# Altium schematic sheet 涂鸦幻彩灯带.SchDoc
size A4
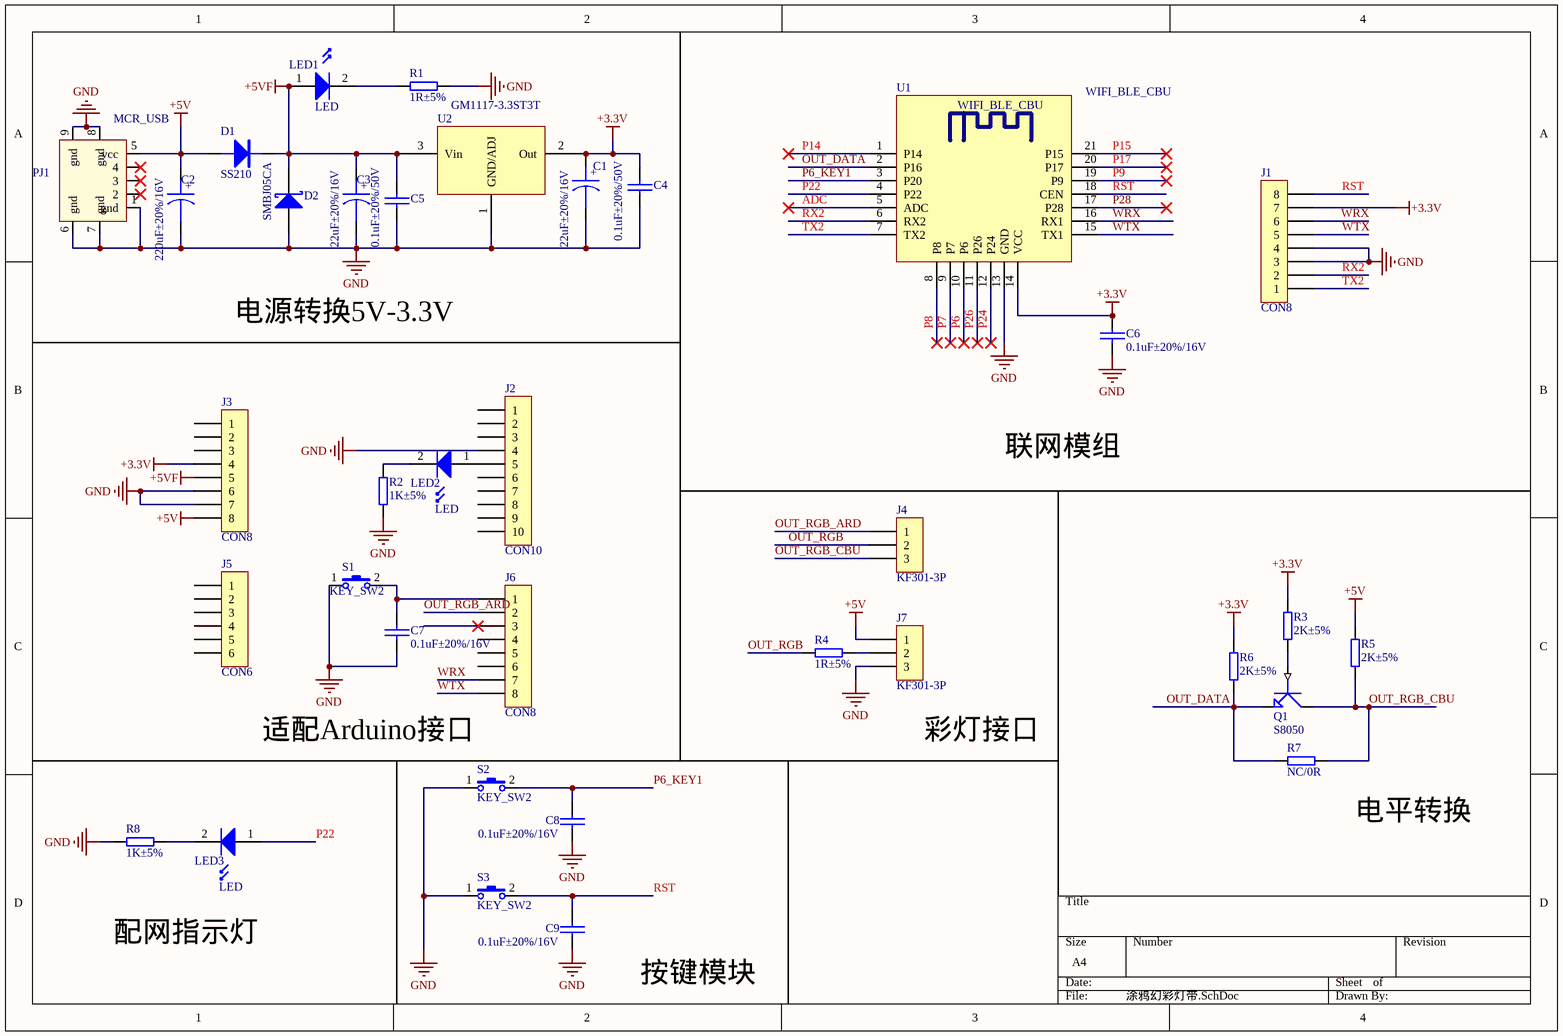
[diagram p0: 涂鸦幻彩灯带.SchDoc]

## Parts
C1  22uF±20%/16V  [钽电容B3528]
C2  220uF±20%/16V  [CD0.15]
C3  22uF±20%/16V  [钽电容B3528]
C4  0.1uF±20%/50V  [C0603]
C5  0.1uF±20%/50V  [C0603]
C6  0.1uF±20%/16V  [C0603]
C7  0.1uF±20%/16V  [C0603]
C8  0.1uF±20%/16V  [C0603]
C9  0.1uF±20%/16V  [C0603]
D1  SS210  [SMA(DO-214AC)]
D2  SMBJ05CA  [SMB(DO-214AA)]
J1  CON8  [HDR1X8Z]
J2  CON10  [HDR1X10Z]
J3  CON8  [HDR1X8Z]
J4  KF301-3P  [SIP3 - 2.54]
J5  CON6  [HDR1X6Z]
J6  CON8  [HDR1X8Z]
J7  KF301-3P  [SIP3 - 2.54]
LED1  LED  [LED0805_1]
LED2  LED  [LED0805_1]
LED3  LED  [LED0805_1]
PJ1  MCR_USB  [MICRO_USB-NEW-16.12.12]
Q1  S8050  [SOT-23-NPN]
R1  1R±5%  [R0603]
R2  1K±5%  [R0603]
R3  2K±5%  [R0603]
R4  1R±5%  [R0603]
R5  2K±5%  [R0603]
R6  2K±5%  [R0603]
R7  NC/0R  [R0603]
R8  1K±5%  [R0603]
S1  KEY_SW2  [KEY4-SMD]
S2  KEY_SW2  [KEY4-SMD]
S3  KEY_SW2  [KEY4-SMD]
U1  WIFI_BLE_CBU  [WIFI_BLE_CBU]
U2  GM1117-3.3ST3T  [SOT-223]

## Nets
+3.3V: C1.1 C4.1 C6.2 J1.7 J3.4 R3.1 R6.1 U1.14(VCC) U2.2(Out)
+5V: C2.1 D1.1 J3.8 J7.1 PJ1.5(vcc) R5.1
+5VF: C3.1 C5.1 D1.2 D2.2(K) J3.5 LED1.1 U2.3(Vin)
GND: C1.2 C2.2 C3.2 C4.2 C5.2 C6.1 C7.2 C8.1 C9.1 D2.1(A) J1.3 J1.4 J2.4 J3.6 J3.7 J7.3 PJ1.1(gnd) PJ1.6(gnd) PJ1.7(gnd) PJ1.8(gnd) PJ1.9(gnd) R1.2 R2.1 R8.2 S1.1 S2.1 S3.1 U1.13(GND) U2.1(GND/ADJ)
ADC: U1.5(ADC)
OUT_DATA: Q1.1(E) R6.2 R7.1 U1.2(P16)
OUT_RGB: J4.2 R4.1
OUT_RGB_ARD: J4.1 J6.2
OUT_RGB_CBU: J4.3 Q1.3(C) R5.2 R7.2
P6: U1.10(P6)
P6_KEY1: C8.2 S2.2 U1.3(P20)
P7: U1.9(P7)
P8: U1.8(P8)
P9: U1.19(P9)
P14: U1.1(P14)
P15: U1.21(P15)
P17: U1.20(P17)
P22: LED3.1 U1.4(P22)
P24: U1.12(P24)
P26: U1.11(P26)
P28: U1.17(P28)
RST: C9.2 J1.8 S3.2 U1.18(CEN)
RX2: J1.2 U1.6(RX2)
TX2: J1.1 U1.7(TX2)
WRX: J1.6 J6.7 U1.16(RX1)
WTX: J1.5 J6.8 U1.15(TX1)
NetC7_1: C7.1 J6.1 S1.2
NetJ2_5: J2.5 LED2.1
NetJ7_2: J7.2 R4.2
NetLED1_2: LED1.2 R1.1
NetLED2_2: LED2.2 R2.2
NetLED3_2: LED3.2 R8.1
NetQ1_2: Q1.2(B) R3.2

Not connected (* = marked no-connect by the designer): J2 1 2 3 6 7 8 9 10; J3 1 2 3; J5 1 2 3 4 5 6; J6 3* 4 5 6; PJ1 2* 3* 4*

## Notes on the sheet
- 电源转换5V-3.3V
- 联网模组
- 适配Arduino接口
- 彩灯接口
- (near R7) 电平转换
- 配网指示灯
- 按键模块
- (in symbol CAPACITOR POL) +

## Library data of the parts
C1-C3 = CAPACITOR POL: Capacitor
C4-C9 = CAP: Capacitor
D1 = Diode1: Diode
D2 = D Schottky: Schottky Diode; MFR: Toshiba
J1 J3 J6 = CON8: Connector
J2 = CON10: Connector
J4 J7 = CON3: Connector
J5 = CON6: Connector
Q1 = NPN: NPN Transistor
R1-R8 = RES5
U1 = WIFI_BLE_CBU: Module
U2 = GM1117
LED1-LED3 = LED: Published: *; LatestRevisionDate: *; LatestRevisionNote: *; DatasheetDocument: *; PackageDocument: *; PackageReference: *; Publisher: *; ComponentLink1Description: *; ComponentLink1URL: *; Code_JEDEC: *
PJ1 = MCR_USB: Published: *; Revision 1: *; Revision 2: *; Datasheet: *; Publisher: *